# Altium schematic sheet 6  - Load Drivers.SchDoc
size 304 x 198 mm
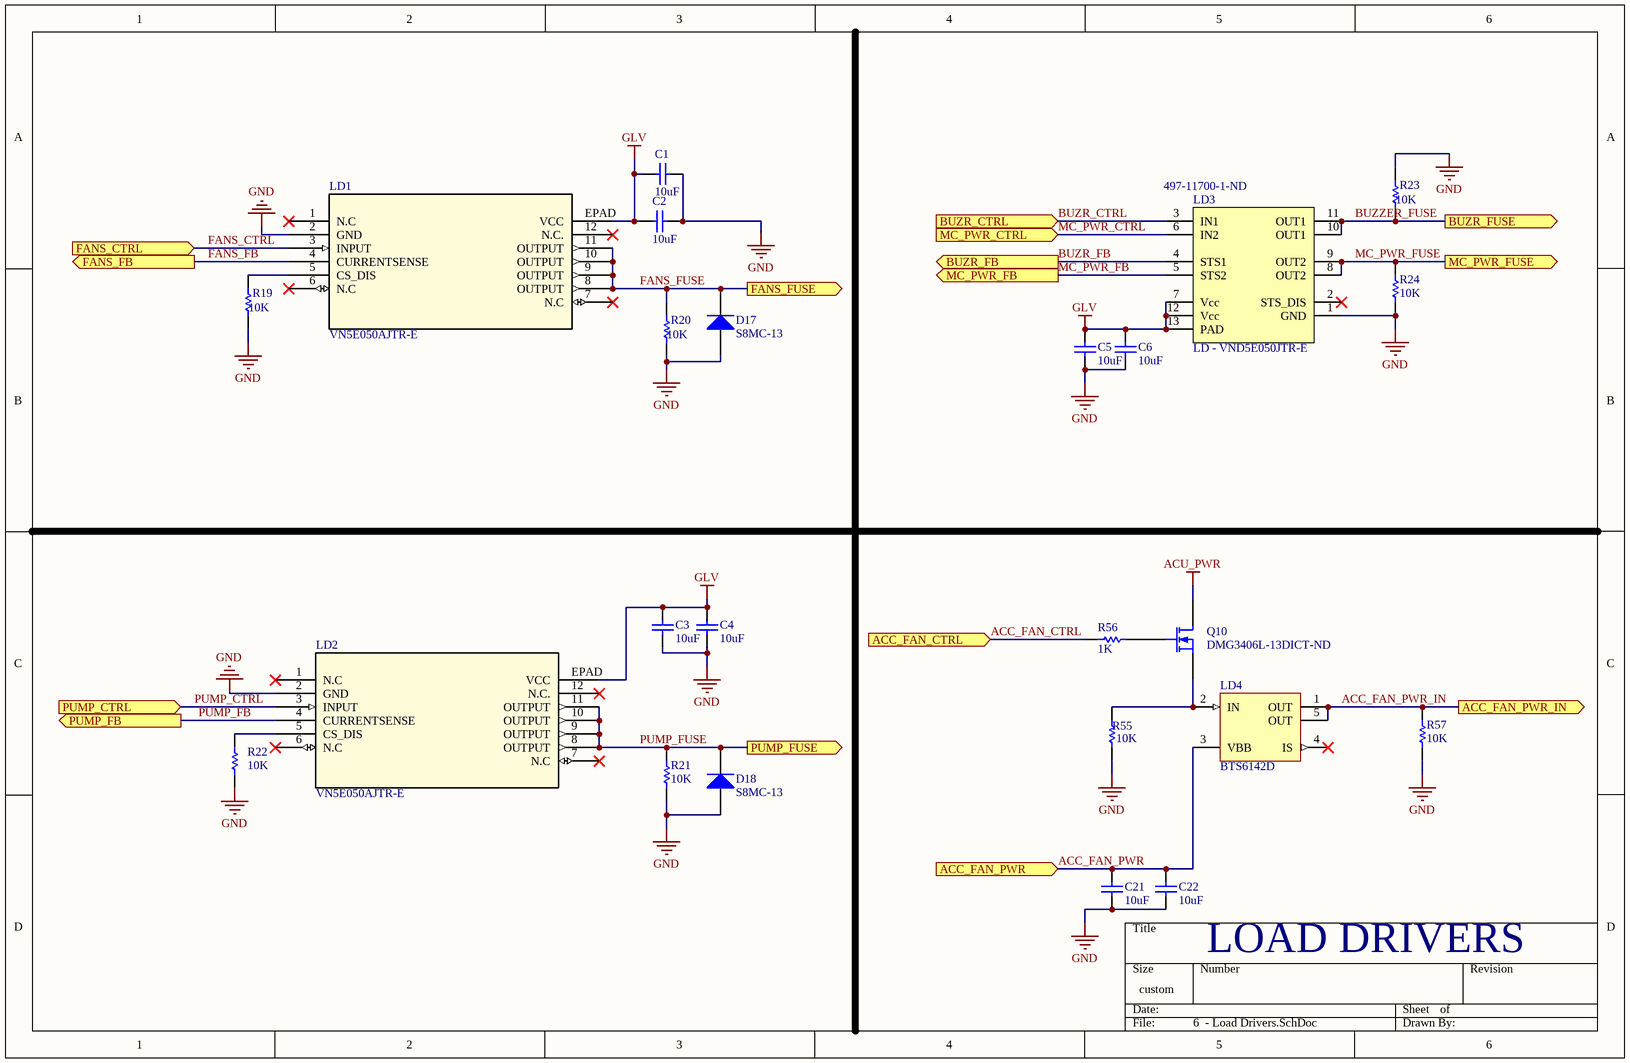
[diagram p0: 6  - Load Drivers.SchDoc]

## Parts
C1  value 10uF  [0603R-generic]  (hidden comment: Cap)
C2  value 10uF  [0603R-generic]  (hidden comment: Cap)
C3  value 10uF  [0603R-generic]  (hidden comment: Cap)
C4  value 10uF  [0603R-generic]  (hidden comment: Cap)
C5  value 10uF  [1608[0603]]  (hidden comment: Cap Semi)
C6  value 10uF  [1608[0603]]  (hidden comment: Cap Semi)
C21  value 10uF  [0603R-generic]  (hidden comment: Cap)
C22  value 10uF  [0603R-generic]  (hidden comment: Cap)
D17  S8MC-13  [S8MC-13]
D18  S8MC-13  [S8MC-13]
LD1  VN5E050AJTR-E  [SO_050AJ-E_STM]
LD2  VN5E050AJTR-E  [SO_050AJ-E_STM]
LD3  LD - VND5E050JTR-E  Supplier Part Number 1: 497-11700-1-ND  [VND5E050JTR-E]
LD4  BTS6142D  [INF-PG-TO252-5-11_M]
Q10  Supplier Part Number 1: DMG3406L-13DICT-ND  [SOT-23_N]
R19  10K  [RESC0603(1608)_L]
R20  10K  [RESC0603(1608)_L]
R21  10K  [RESC0603(1608)_L]
R22  10K  [RESC0603(1608)_L]
R23  10K  [RESC0603(1608)_L]
R24  10K  [RESC0603(1608)_L]
R55  10K  [RESC0603(1608)_L]
R56  1K  [RESC0603(1608)_L]
R57  10K  [RESC0603(1608)_L]

## Ports
ACC_FAN_CTRL (in), ACC_FAN_PWR (in), ACC_FAN_PWR_IN (out), BUZR_CTRL (in), BUZR_FB (out), BUZR_FUSE (out), FANS_CTRL (in), FANS_FB (out), FANS_FUSE (out), MC_PWR_CTRL (in), MC_PWR_FB (out), MC_PWR_FUSE (out), PUMP_CTRL (in), PUMP_FB (out), PUMP_FUSE (out)

## Nets
ACU_PWR: Q10.3(D)
GLV: C1.2 C2.2 C3.2 C4.2 C5.2 C6.2 LD1.EPAD(VCC) LD2.EPAD(VCC) LD3.7(Vcc) LD3.12(Vcc) LD3.13(PAD)
GND: C1.1 C2.1 C3.1 C4.1 C5.1 C6.1 C21.1 C22.1 D17.1(A) D18.1(A) LD1.2(GND) LD2.2(GND) LD3.1(GND) R19.1 R20.1 R21.1 R22.1 R23.2 R24.2 R55.2 R57.2
ACC_FAN_CTRL: R56.1 ; port ACC_FAN_CTRL
ACC_FAN_PWR: C21.2 C22.2 LD4.3(VBB) ; port ACC_FAN_PWR
ACC_FAN_PWR_IN: LD4.1(OUT) LD4.5(OUT) R57.1 ; port ACC_FAN_PWR_IN
BUZR_CTRL: LD3.3(IN1) ; port BUZR_CTRL
BUZR_FB: LD3.4(STS1) ; port BUZR_FB
BUZZER_FUSE: LD3.10(OUT1) LD3.11(OUT1) R23.1 ; port BUZR_FUSE
FANS_CTRL: LD1.3(INPUT) ; port FANS_CTRL
FANS_FB: LD1.4(CURRENTSENSE) ; port FANS_FB
FANS_FUSE: D17.2(K) LD1.8(OUTPUT) LD1.9(OUTPUT) LD1.10(OUTPUT) LD1.11(OUTPUT) R20.2 ; port FANS_FUSE
MC_PWR_CTRL: LD3.6(IN2) ; port MC_PWR_CTRL
MC_PWR_FB: LD3.5(STS2) ; port MC_PWR_FB
MC_PWR_FUSE: LD3.8(OUT2) LD3.9(OUT2) R24.1 ; port MC_PWR_FUSE
PUMP_CTRL: LD2.3(INPUT) ; port PUMP_CTRL
PUMP_FB: LD2.4(CURRENTSENSE) ; port PUMP_FB
PUMP_FUSE: D18.2(K) LD2.8(OUTPUT) LD2.9(OUTPUT) LD2.10(OUTPUT) LD2.11(OUTPUT) R21.2 ; port PUMP_FUSE
NetLD1_5: LD1.5(CS_DIS) R19.2
NetLD2_5: LD2.5(CS_DIS) R22.2
NetLD4_2: LD4.2(IN) Q10.2(S) R55.1
NetQ10_1: Q10.1(G) R56.2

Not connected (* = marked no-connect by the designer): LD1 1(N.C)* 6(N.C)* 7(N.C)* 12(N.C.)*; LD2 1(N.C)* 6(N.C)* 7(N.C)* 12(N.C.)*; LD3 2(STS_DIS)*; LD4 4(IS)*

## Notes on the sheet
- (near C22) LOAD DRIVERS

## Library data of the parts
C1-C4 C21 C22 = Cap: Capacitor; Manufacturer: Yageo; Manufacturer Part Number: CC1210ZKY5V8BB106; Capacitance: 10µF; Tolerance: -20%, +80%; Voltage - Rated: 25V; Temperature Coefficient: Y5V (F); Supplier 1: Digi-Key; Supplier Part Number 1: 311-2063-1-ND; RoHS: RoHS Compliant; Category: Capacitors; Stock 1: 1156; Pricing 1: 1=0.47, 10=0.323, 25=0.258, 50=0.2154, 100=0.1829, 250=0.14528, 500=0.12912, 1000=0.11298 (CAD); Packaging: Cut Tape (CT); Part Status: Active; Operating Temperature: -30°C ~ 85°C; Features: -; Ratings: -; Applications: General Purpose; Failure Rate: -; Mounting Type: Surface Mount, MLCC; Package / Case: 1210 (3225 Metric); Size / Dimension: 0.126" L x 0.098" W (3.20mm x 2.50mm); Height - Seated (Max): -; Thickness (Max): 0.083" (2.10mm); Lead Spacing: -; Lead Style: -; ComponentLink1URL: http://www.yageo.com/documents/recent/UPY-GPHC_Y5V_6.3V-to-50V_7.pdf; ComponentLink1Description: http://www.yageo.com/documents/recent/UPY-GPHC_Y5V_6.3V-to-50V_7.pdf; Supplier 2: Digi-Key; Supplier Part Number 2: 1276-1869-1-ND
C5 C6 = Cap Semi: Capacitor (Semiconductor SIM Model); Published: 8-Jun-2000; LatestRevisionDate: 29-May-2009; LatestRevisionNote: IPC-7351 Footprint Added.; PackageReference: C1206; Publisher: Altium Limited; PackageDescription: Chip Capacitor; Supplier 1: Digi-Key; Supplier Part Number 1: 490-10991-1-ND
D17 D18 = Diode: Default Diode; Supplier 1: Digi-Key; Supplier Part Number 1: S8MCDICT-ND
LD3 = LOAD DRIVER - VND5E050JTR-E: Supplier 1: Digi-Key
LD4 = CMP-1095-00109-1: Smart High-Side Power Switch PROFET, 12 mOhm, 1 Channel, 8.5 A Load Current, -40 to 150 degC, PG-TO252-5-11, Reel, Green; Manufacturer: Infineon; toff (max): 600 us; Group: Automotive Qualified; Green: TRUE; Channels: 1; Recommended Operating Voltage Max.: 24 V; Load Current (typ): 8.5 A; RON(max) @ 150degreesC: 22 mOhm; RON @ 25degreesC: 12 mOhm; Ptot (max): 50 W; Recommended Operating Voltage Min.: 5.5 V; Halogen-free: TRUE; ComponentLink3Description: Package Specification; Mounting Technology: Surface Mount; PackageVersion: Nov-10; ComponentLink2URL: http://www.infineon.com/dgdl/BTS6142D_DS_v11.pdf?folderId=db3a304314dca389011537739e37155f&fileId=db3a3043183a9555011860661a7d367a&location=en.Products.Automotive_ICs.Smart_High-_and_Low-Side_Switches.PROFET__-_Smart_High_Side_Switches.DATASHEET.BTS6142D_D; PackageReference: PG-TO252-5-11; ComponentLink3URL: http://www.infineon.com/dgdl/TLE7276-Data+Sheet-+v1_11.pdf?folderId=db3a304412b407950112b408e8c90004&fileId=db3a304412b407950112b436c53f66c8&sId=db3a30433db6f09f013dc0e43c0428c1; ComponentLink2Description: Datasheet; ComponentLink1URL: http://www.infineon.com/; Packing: Reel; ComponentLink1Description: Manufacturer URL; DatasheetVersion: Rev. 1.1; ton (max): 600 us; PartNumber: BTS6142D; PackageDescription: 5-Pin Plastic (Green) Transistor Single Outline Package, 6.5 x 6.12 mm Body, 1.14 mm Pitch
Q10 = MOSFET-N: N-Channel MOSFET; Manufacturer: Infineon Technologies; Manufacturer Part Number: IPD075N03L G; FET Type: MOSFET N-Channel, Metal Oxide; FET Feature: Logic Level Gate; Drain to Source Voltage (Vdss): 30V; Current - Continuous Drain (Id) @ 25°C: 50A (Tc); Rds On (Max) @ Id, Vgs: 7.5 mOhm @ 30A, 10V; Vgs(th) (Max) @ Id: 2.2V @ 250µA; Gate Charge (Qg) @ Vgs: 18nC @ 10V; Input Capacitance (Ciss) @ Vds: 1900pF @ 15V; Power - Max: 47W; Published: 8-Jun-2000; LatestRevisionDate: 17-Jul-2002; LatestRevisionNote: Re-released for DXP Platform.; PackageVersion: 1995/1996; PackageReference: E3; Publisher: Altium Limited; PackageDescription: TO, Flat Index; 3 In-Line, Axial Leads; Body Dia. 4.6mm; Lead Dia. 0.5 mm (max); RoHS: RoHS Compliant; Category: Discrete Semiconductor Products; Packaging: Cut Tape (CT); Mounting Type: Surface Mount; Package / Case: TO-252-3, DPak (2 Leads + Tab), SC-63; Supplier Device Package: PG-TO252-3; ComponentLink1URL: http://www.infineon.com/dgdl/Infineon-IPD075N03LG-DS-v02_01-en.pdf?folderId=5546d4694909da4801490a07012f053b&fileId=db3a30431936bc4b011951d824f83aeb; ComponentLink1Description: http://www.infineon.com/dgdl/Infineon-IPD075N03LG-DS-v02_01-en.pdf?folderId=5546d4694909da4801490a07012f053b&fileId=db3a30431936bc4b011951d824f83aeb; ComponentLink2URL: http://www.semicon.toshiba.co.jp/info/docget.jsp?type=datasheet&lang=en&pid=SSM3K329R; ComponentLink2Description: http://www.semicon.toshiba.co.jp/info/docget.jsp?type=datasheet&lang=en&pid=SSM3K329R; Supplier 1: Digi-Key
R19-R24 R55-R57 = CMP-1591-00001-1: 0603 (1608 Metric) Chip Resistor; Case-Metric: 1608; Case-EIA: 0603; PackageReference: RESC0603(1608)
  R19-R24 R55 R57: Supplier 1: Digi-Key; Supplier Part Number 1: 311-10KGRCT-ND